# EAGLE design Orion CanSat Europe (EAGLE 9.2.2)
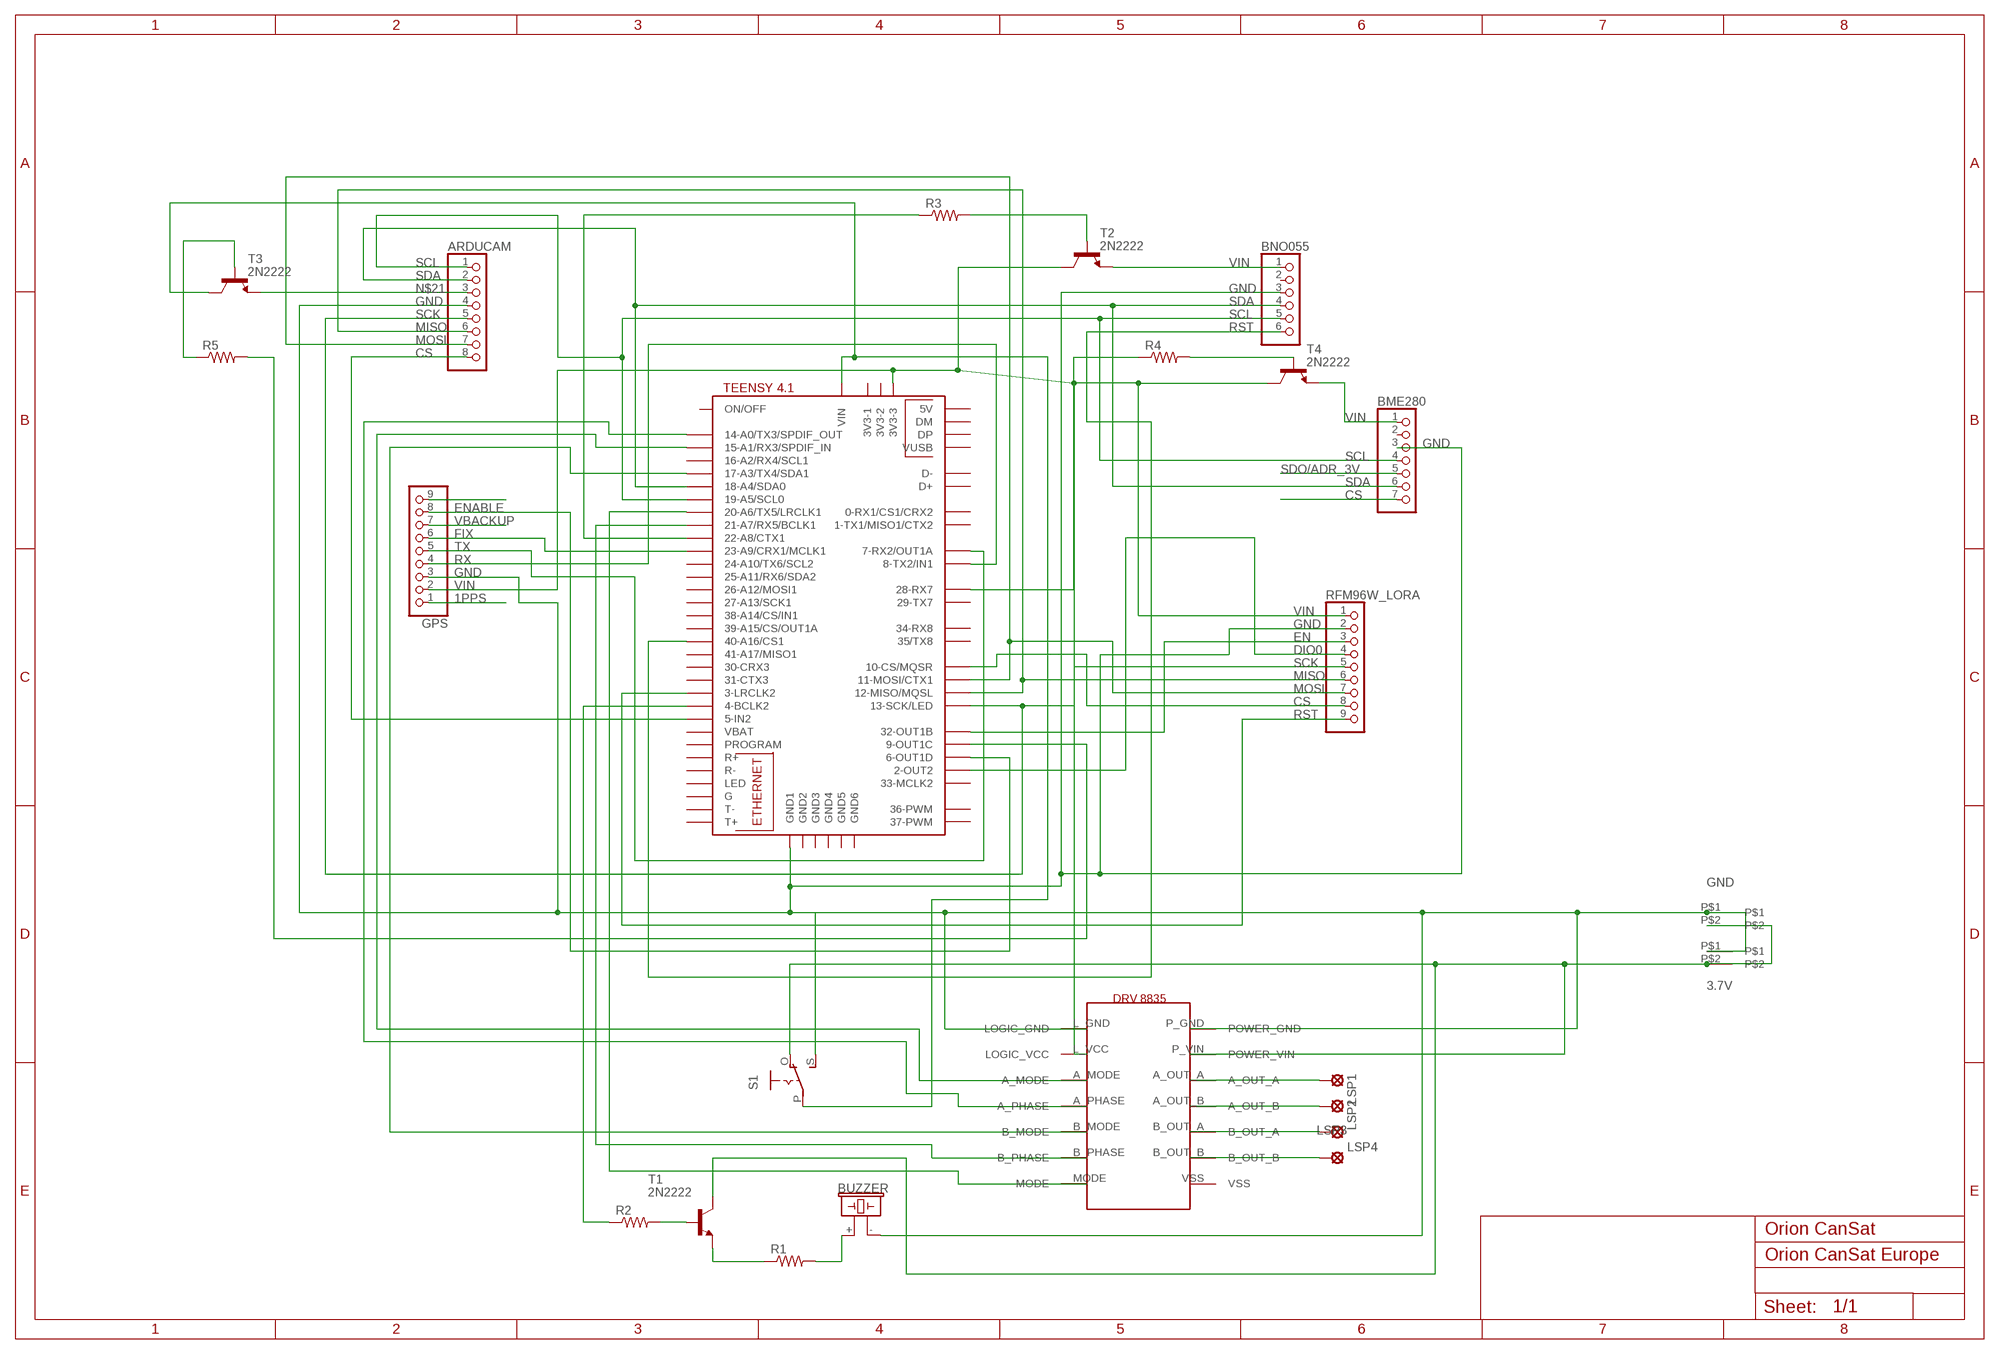
[diagram p0: schematic, sheet 1]

## Parts
ARDUCAM  PINHD-1X8BIG  [1X08-BIG]
BME280  HEADER-1X770MIL  [1X07_ROUND_70]
BNO055  HEADER-1X676MIL  [1X06_ROUND_76]
GPS  HEADER-1X970MIL  [1X09_ROUND_70]
LSP1  LSP13  [LSP13]
LSP2  LSP13  [LSP13]
LSP3  LSP13  [LSP13]
LSP4  LSP13  [LSP13]
R1  FLIPFLOP-RES  [0805-THM]
R2  FLIPFLOP-RES  [0805-THM]
R3  FLIPFLOP-RES  [0805-THM]
R4  FLIPFLOP-RES  [0805-THM]
R5  FLIPFLOP-RES  [0805-THM]
RFM96W_LORA  HEADER-1X970MIL  [1X09_ROUND_70]
S1  EG1218S  [EG1218]
SG2  F/CM12P  [F/CM12P]
T1  2N2222  [TO92-EBC-OVAL]
T2  2N2222  [TO92-EBC-OVAL]
T3  2N2222  [TO92-EBC-OVAL]
T4  2N2222  [TO92-EBC-OVAL]
U$1  DRV8835  [DRV8835]
U$5  TEENSY41  [TEENSY41]
U$7  2PINS  [2PINS]
U$8  2PINS  [2PINS]

## Nets
1PPS: GPS.1
BZPWR: R1.2 SG2.+
CS: ARDUCAM.8 U$5.5-IN2
CS_5V: BME280.7 RFM96W_LORA.8 U$5.10-CS\MQSR(10-CS/MQSR)
DIO0: RFM96W_LORA.4 U$5.2-OUT2
EN: RFM96W_LORA.3 U$5.32-OUT1B
ENABLE: GPS.8 U$5.6-OUT1D
FIX: GPS.6 U$5.23-A9/CRX1/MCLK1
GND: ARDUCAM.4 BME280.3 BNO055.3 GPS.3 RFM96W_LORA.2 S1.S SG2.- U$1.L_GND(LOGIC_GND) U$1.P_GND(POWER_GND) U$5.GND1 U$7.P$1 U$8.P$1
MISO: ARDUCAM.6 RFM96W_LORA.6 U$5.12-MISO/MQSL
MOSI: ARDUCAM.7 RFM96W_LORA.7 U$5.11-MOSI/CTX1
N$1: R1.1 T1.E
N$2: U$1.MODE U$5.20-A6/TX5/LRCLK1
N$3: U$1.A_PHASE U$5.14-A0/TX3/SPDIF_OUT
N$4: R3.1 U$5.22-A8/CTX1
N$5: U$1.B_PHASE U$5.21-A7/RX5/BCLK1
N$6: R5.2 U$5.9-OUT1C
N$7: U$1.A_MODE U$5.15-A1/RX3/SPDIF_IN
N$8: R4.1 U$5.28-RX7
N$9: LSP1.MP U$1.A_OUT_A
N$10: R2.2 T1.B
N$11: LSP2.MP U$1.A_OUT_B
N$12: LSP3.MP U$1.B_OUT_A
N$13: LSP4.MP U$1.B_OUT_B
N$14: R4.2 T4.B
N$15: R3.2 T2.B
N$16: GPS.2 RFM96W_LORA.1 T2.C T4.C U$1.L_VCC(LOGIC_VCC) U$5.3V3-3
N$17: U$1.B_MODE U$5.17-A3/TX4/SDA1
N$18: GPS.9
N$19: BNO055.1 T2.E
N$20: BME280.1 T4.E
N$21: ARDUCAM.3 T3.E
N$22: S1.P T3.C U$5.VIN
N$23: R5.1 T3.B
N$24: S1.O T1.C U$1.P_VIN(POWER_VIN) U$7.P$2 U$8.P$2
N$29: R2.1 U$5.4-BCLK2
RST: BNO055.6 RFM96W_LORA.9 U$5.3-LRCLK2 U$5.40-A16/CS1
RX: GPS.4 U$5.8-TX2/IN1
SCK: ARDUCAM.5 RFM96W_LORA.5 U$5.13-SCK/LED
SCL: ARDUCAM.1 BME280.4 BNO055.5 U$5.19-A5/SCL0
SDA: ARDUCAM.2 BME280.6 BNO055.4 U$5.18-A4/SDA0
SDO/ADR_3V: BME280.5
TX: GPS.5 U$5.7-RX2/OUT1A
VBACKUP: GPS.7
Unconnected: BME280.2 BNO055.2 U$1.VSS U$5.0-RX1/CS1/CRX2 U$5.1-TX1/MISO1/CTX2 U$5.3V3-1 U$5.3V3-2 U$5.16-A2/RX4/SCL1 U$5.24-A10/TX6/SCL2 U$5.25-A11/RX6/SDA2 U$5.26-A12/MOSI1 U$5.27-A13/SCK1 U$5.29-TX7 U$5.30-CRX3 U$5.31-CTX3 U$5.33-MCLK2 U$5.34-RX8 U$5.35-TX8(35/TX8) U$5.36-PWM U$5.37-PWM U$5.38-A14/CS/IN1 U$5.39-A15/CS/OUT1A U$5.41-A17/MISO1 U$5.+5V(5V) U$5.D+ U$5.D- U$5.DM U$5.DP U$5.G U$5.GND2 U$5.GND3 U$5.GND4 U$5.GND5 U$5.GND6 U$5.LED U$5.ON/OFF U$5.PROGRAM U$5.R+ U$5.R- U$5.T+ U$5.T- U$5.VBAT U$5.VUSB

## Notes on the sheet
- VIN
- GND
- VIN
- GND
- CS
- GND
- VIN
- VIN
- GND
- CS
- 9V_BATTERY
- GND
- VIN | GND
- 3.7V
- BUZZER
- Orion CanSat

## Library data of the parts
ARDUCAM = adafruit:PINHD-1X8: PIN HEADER
BME280 = microbuilder:HEADER-1X7: PIN HEADER
BNO055 = microbuilder:HEADER-1X6: PIN HEADER
GPS RFM96W_LORA = microbuilder:HEADER-1X9: PIN HEADER
LSP1-LSP4 = solpad:LSP13: SOLDER PAD drill 1.3 mm, distributor Buerklin, 12H562
R1-R5 = adafruit:FLIPFLOP-RES: Flip Flop resistor An 0805 resistor inside a standard 1/4W 5% resistor. Makes for easy mods
S1 = switch:EG1218: SLIDING SWITCH 0.1" spacing through hole, vertical SPDT slide switch http://www.ladyada.net/library/pcb/eaglelibrary.html
SG2 = buzzer:F/CM12P: BUZZER Source: Buerklin; OC_FARNELL: unknown; OC_NEWARK: unknown
T1-T4 = adafruit:2N2222: NPN TRANSISTOR Big oval pads
U$1 = DRV 8835:DRV8835
U$5 = teensy:TEENSY41
U$7 U$8 = 6pins:2PINS

## Board
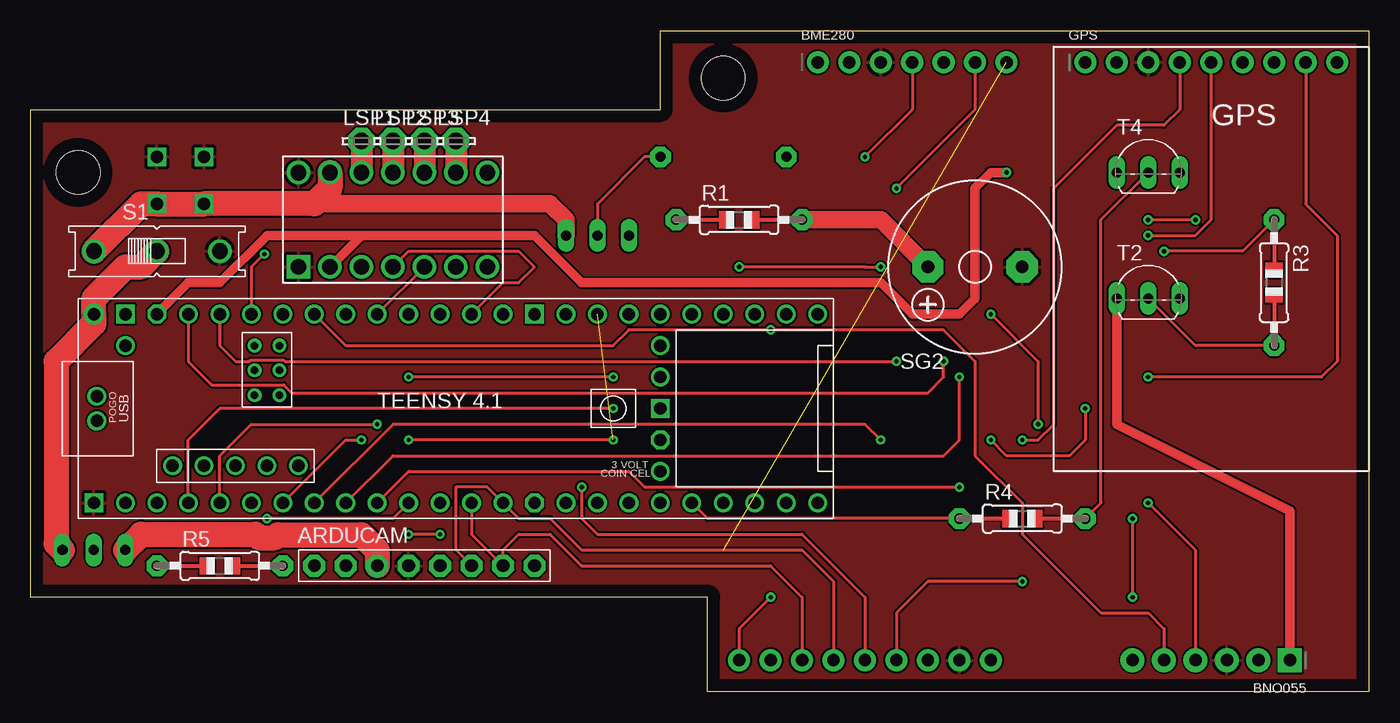
[diagram p1: board, top side]
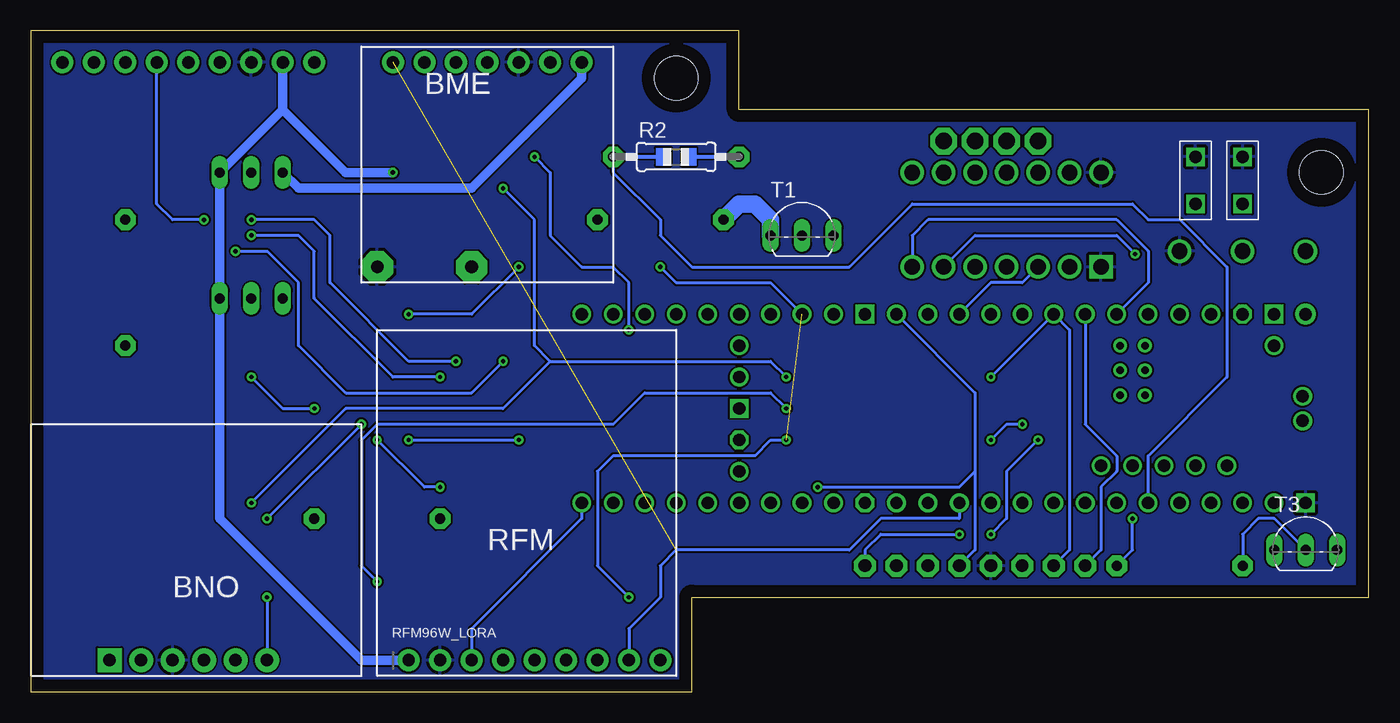
[diagram p2: board, bottom side, seen from below]

Size 107.95 x 53.34 mm. Coordinates in mm from the lower left corner, seen from the top.
Outline: 0,46.99 50.8,46.99 50.8,53.34 107.95,53.34 107.95,0 54.61,0 54.61,7.62 0,7.62 0,46.99
Copper layers (1*16): Top 0.035mm / dielectric 1.5mm / Bottom 0.035mm
Design rules "default": minimum track width 6mil, minimum drill 0.35mm, track to track 6mil, track to pad 6mil, pad to pad 6mil, via to via 6mil, smd to smd 6mil, copper to edge 40mil, drill to drill 6mil, minimum pad ring 10mil, minimum via ring 8mil, stop-mask expansion 4mil, vias tented up to drill 0mil, thermal gap 10mil
Holes 3.5 mm at 55.88,49.53 3.81,41.91

### Footprints (pad centres in the part's own frame; a part is rotated, then mirrored left to right if it is on the bottom)
1X08-BIG = drill 1.016 pad 1.778 octagon: 1 -8.89,0; 2 -6.35,0; 3 -3.81,0; 4 -1.27,0; 5 1.27,0; 6 3.81,0; 7 6.35,0; 8 8.89,0
1X07_ROUND_70 = drill 1 pad 1.778: 1 -7.62,0; 2 -5.08,0; 3 -2.54,0; 4 0,0; 5 2.54,0; 6 5.08,0; 7 7.62,0
1X06_ROUND_76 = drill 1 pad 1.93 square: 1 -6.35,0 | drill 1 pad 1.93: 2 -3.81,0; 3 -1.27,0; 4 1.27,0; 5 3.81,0; 6 6.35,0
1X09_ROUND_70 = drill 1 pad 1.778: 1 -10.16,0; 2 -7.62,0; 3 -5.08,0; 4 -2.54,0; 5 0,0; 6 2.54,0; 7 5.08,0; 8 7.62,0; 9 10.16,0
LSP13 = drill 1.321 pad 2.159 octagon: MP 0,0
0805-THM = drill 0.813 pad 1.676 octagon: 1 -5.08,0; 2 5.08,0
EG1218 = drill 1.27 pad 1.676: O -5.08,0; P 0,0; S 5.08,0
F/CM12P = drill 1.016 pad 2.54 octagon: + 3.81,0; - -3.81,0
TO92-EBC-OVAL = drill 0.813 long: B 0,-1.27; C 2.54,-1.27; E -2.54,-1.27
DRV8835 = drill 1.27: A_MODE -3.81,3.81; A_OUT_A 3.81,3.81; A_OUT_B 3.81,1.27; A_PHASE -3.81,1.27; B_MODE -3.81,-1.27; B_OUT_A 3.81,-1.27; B_OUT_B 3.81,-3.81; B_PHASE -3.81,-3.81; L_VCC -3.81,6.35; MODE -3.81,-6.35; P_GND 3.81,8.89; P_VIN 3.81,6.35; VSS 3.81,-6.35 | drill 1.27 square: L_GND -3.81,8.89
TEENSY41 = drill 1: 0-RX1/CS1/CRX2 -27.94,-7.62; 1-TX1/MISO1/CTX2 -25.4,-7.62; 2-OUT2 -22.86,-7.62; 3-LRCLK2 -20.32,-7.62; 4-BCLK2 -17.78,-7.62; 5-IN2 -15.24,-7.62; 6-OUT1D -12.7,-7.62; 7-RX2/OUT1A -10.16,-7.62; 8-TX2/IN1 -7.62,-7.62; 9-OUT1C -5.08,-7.62; 10-CS\MQSR -2.54,-7.62; 11-MOSI/CTX1 0,-7.62; 12-MISO/MQSL 2.54,-7.62; 13-SCK/LED 2.54,7.62; 14-A0/TX3/SPDIF_OUT 0,7.62; 15-A1/RX3/SPDIF_IN -2.54,7.62; 16-A2/RX4/SCL1 -5.08,7.62; 17-A3/TX4/SDA1 -7.62,7.62; 18-A4/SDA0 -10.16,7.62; 19-A5/SCL0 -12.7,7.62; 20-A6/TX5/LRCLK1 -15.24,7.62; 21-A7/RX5/BCLK1 -17.78,7.62; 22-A8/CTX1 -20.32,7.62; 23-A9/CRX1/MCLK1 -22.86,7.62; 24-A10/TX6/SCL2 7.62,-7.62; 25-A11/RX6/SDA2 10.16,-7.62; 26-A12/MOSI1 12.7,-7.62; 27-A13/SCK1 15.24,-7.62; 28-RX7 17.78,-7.62; 29-TX7 20.32,-7.62; 30-CRX3 22.86,-7.62; 31-CTX3 25.4,-7.62; 32-OUT1B 27.94,-7.62; 33-MCLK2 27.94,7.62; 34-RX8 25.4,7.62; 35-TX8 22.86,7.62; 36-PWM 20.32,7.62; 37-PWM 17.78,7.62; 38-A14/CS/IN1 15.24,7.62; 39-A15/CS/OUT1A 12.7,7.62; 40-A16/CS1 10.16,7.62; 41-A17/MISO1 7.62,7.62; +5V -24.13,-4.62; D+ -30.25,-1; D- -30.25,1; DM -21.59,-4.62; DP -19.05,-4.62; GND4 -16.51,-4.62; GND5 -13.97,-4.62; ON/OFF 15.24,5.08; PROGRAM 15.24,2.54; VBAT 15.24,-5.08; VUSB -27.94,5.08 | drill 1 octagon: 3V3-1 5.08,-7.62; 3V3-2 15.24,-2.54; 3V3-3 -25.4,7.62 | drill 0.6: G -15.51,3.08; LED -17.51,3.08; R+ -17.51,5.08; R- -15.51,5.08; T+ -15.51,1.08; T- -17.51,1.08 | drill 1 square: GND1 -30.48,-7.62; GND2 15.24,0; GND3 5.08,7.62; GND6 -27.94,7.62 | drill 1 pad 1.676: VIN -30.48,7.62
2PINS = drill 1 square: P$1 0,2.54; P$2 0,-1.27

### Placement (x,y rotation side)
ARDUCAM  31.75,10.16 0 top
BME280  71.12,50.8 0 top
BNO055  95.25,2.54 180 top
GPS  95.25,50.8 0 top
LSP1  26.67,44.45 0 top
LSP2  29.21,44.45 0 top
LSP3  31.75,44.45 0 top
LSP4  34.29,44.45 0 top
R1  57.15,38.1 0 top
R2  55.88,43.18 0 bottom
R3  100.33,33.02 270 top
R4  80.01,13.97 0 top
R5  15.24,10.16 0 top
RFM96W_LORA  67.31,2.54 0 bottom
S1  10.16,35.56 0 top
SG2  76.2,34.29 180 top
T1  45.72,38.1 0 bottom
T2  90.17,33.02 0 top
T3  5.08,12.7 0 bottom
T4  90.17,43.18 0 top
U$1  30.48,38.1 90 top
U$5  35.56,22.86 0 top
U$7  10.16,40.64 0 top
U$8  13.97,40.64 0 top

### Tracks (layer width: path | path; a pad name or v marks a point on that pad's centre or on a via)
BZPWR
  Top 1.397: SG2.+ 68.58,38.1 R1.2
CS  (via drill 0.35)
  Top 0.254: v26.67,20.32 25.4,20.32 U$5.5-IN2 | v33.02,12.7 v30.48,12.7
  Bottom 0.254: v26.67,20.32 29.21,17.78 29.21,13.97 v30.48,12.7 | ARDUCAM.8 40.64,11.43 39.37,12.7 v33.02,12.7
CS_5V  (1 unrouted)
  Bottom 0.254: U$5.10-CS\MQSR 33.02,13.97 39.37,13.97 41.91,11.43 55.88,11.43 57.15,10.16 57.15,7.62 59.69,5.08 RFM96W_LORA.8
DIO0  (via drill 0.35)
  Top 0.254: U$5.2-OUT2 12.7,20.32 15.24,22.86 v46.99,22.86 | v80.01,8.89 72.39,8.89 69.85,6.35 RFM96W_LORA.4
  Bottom 0.254: v46.99,22.86 48.26,24.13 58.42,24.13 60.96,21.59 80.01,21.59 81.28,20.32 81.28,10.16 v80.01,8.89
EN
  Bottom 0.254: U$5.32-OUT1B 63.5,13.97 72.39,5.08 RFM96W_LORA.3
ENABLE  (via drill 0.35)
  Top 0.254: U$5.6-OUT1D 29.21,21.59 67.31,21.59 v68.58,20.32 | GPS.8 102.87,39.37 105.41,36.83 105.41,26.67 104.14,25.4 v90.17,25.4 | v85.09,22.86 85.09,20.32 83.82,19.05 78.74,19.05 v77.47,20.32
  Bottom 0.254: v90.17,25.4 87.63,22.86 v85.09,22.86 | v77.47,20.32 v68.58,20.32
FIX  (via drill 0.35)
  Top 0.254: U$5.23-A9/CRX1/MCLK1 12.7,26.67 14.6,24.77 20.39,24.77 21.04,24.13 72.39,24.13 73.66,25.4 v73.66,26.67 | v90.17,38.1 v93.98,38.1
  Bottom 0.254: v73.66,26.67 77.47,26.67 83.82,33.02 83.82,36.83 85.09,38.1 v90.17,38.1 | v93.98,38.1 96.52,38.1 97.79,39.37 GPS.6
GND
  pour Top: -1.27,54.61 -1.27,-1.27 110.49,-1.27 110.49,54.61
  pour Bottom: -2.54,-2.54 -2.54,55.88 111.76,55.88 111.76,-2.54
MISO
  Top 0.254: ARDUCAM.6 34.29,11.43 34.29,16.51 36.83,16.51 U$5.12-MISO/MQSL 39.37,13.97 41.91,13.97 44.45,11.43 62.23,11.43 64.77,8.89 RFM96W_LORA.6
MOSI
  Top 0.254: U$5.11-MOSI/CTX1 35.56,12.7 ARDUCAM.7 38.1,11.43 39.37,12.7 41.91,12.7 44.45,10.16 59.69,10.16 62.23,7.62 RFM96W_LORA.7
N$1
  Bottom 1.397: R1.1 50.8,39.37 49.53,39.37 48.26,38.1 T1.E
N$2
  Bottom 0.254: U$5.20-A6/TX5/LRCLK1 17.78,33.02 17.78,35.56 20.32,38.1 35.56,38.1 36.83,36.83 U$1.MODE
N$3
  Top 0.254: U$1.A_PHASE 30.48,35.56 39.37,35.56 40.64,34.29 39.37,33.02 38.1,33.02 U$5.14-A0/TX3/SPDIF_OUT
N$4  (via drill 0.35)
  Top 0.254: U$5.22-A8/CTX1 15.24,27.94 16.51,26.67 17.6,26.67 17.7,26.77 20.39,26.77 20.5,26.67 v69.85,26.67 | R3.1 100.18,37.95 100.15,37.95 99.9,37.7 99.9,37.67 97.79,35.56 v91.44,35.56
  Bottom 0.254: v69.85,26.67 72.39,24.13 82.55,24.13 86.36,27.94 86.36,33.02 88.9,35.56 v91.44,35.56
N$5  (via drill 0.35)
  Top 0.254: U$5.21-A7/RX5/BCLK1 17.78,34.29 18.82,35.33 v18.84,35.33
  Bottom 0.254: U$1.B_PHASE 31.75,36.83 20.32,36.83 18.82,35.33 v18.84,35.33
N$6  (via drill 0.35)
  Top 0.254: v19.05,13.97 29.21,13.97 U$5.9-OUT1C
  Bottom 0.254: R5.2 19.05,11.43 v19.05,13.97
N$7
  Bottom 0.254: U$5.15-A1/RX3/SPDIF_IN 30.48,33.02 27.94,33.02 U$1.A_MODE
N$8
  Top 0.254: U$5.28-RX7 54.61,13.97 R4.1
N$9
  Top 1.778: LSP1.MP U$1.A_OUT_A
N$10
  Top 0.254: T1.B 45.72,39.37 49.53,43.18 R2.2
N$11
  Top 1.778: LSP2.MP U$1.A_OUT_B
N$12
  Top 1.778: LSP3.MP U$1.B_OUT_A
N$13
  Top 1.778: LSP4.MP U$1.B_OUT_B
N$14
  Top 0.254: T4.B 86.36,38.1 86.36,15.24 R4.2
N$15
  Top 0.254: T2.B 93.98,27.94 R3.2
N$16  (via drill 0.35)
  Top 0.762: 26.67,36.83 40.64,36.83 44.45,33.02 68.58,33.02 71.12,30.48 74.93,30.48 76.2,31.75 76.2,40.64 77.47,41.91 v78.74,41.91 | U$1.L_VCC 26.67,36.83 | 26.67,36.83 19.05,36.83 15.24,33.02 12.7,33.02 U$5.3V3-3
  Bottom 0.762: RFM96W_LORA.1 81.28,2.54 92.71,13.97 T2.C T4.C 87.63,46.99 | v78.74,41.91 82.55,41.91 87.63,46.99 | GPS.2 87.63,46.99
N$17
  Top 0.254: U$1.B_MODE U$5.17-A3/TX4/SDA1
N$19
  Top 0.762: T2.E 87.63,21.59 101.6,14.61 BNO055.1
N$20
  Bottom 0.762: T4.E 86.36,40.64 72.39,40.64 63.5,49.53 BME280.1
N$21
  Top 2.032: T3.E 8.89,12.7 18.13,12.7 18.41,12.42 19.69,12.42 19.94,12.68 26.67,12.68 27.94,11.41 ARDUCAM.3
N$22
  Top 2.032: T3.C 2.03,11.94 2.03,26.67 5.08,29.72 U$5.VIN 5.08,31.75 7.62,34.29 8.89,34.29 S1.P
N$23
  Bottom 0.254: R5.1 10.16,12.7 8.89,13.97 7.62,13.97 T3.B
N$24
  Top 1.397: 22.86,39.4 41.91,39.4 41.91,39.37 43.18,38.1 T1.C
  Top 2.032: S1.O 8.89,39.37 U$7.P$2 U$8.P$2 13.99,39.4 22.86,39.4 22.89,39.4 24.13,40.64 U$1.P_VIN
N$29
  Bottom 0.254: U$5.4-BCLK2 17.78,19.05 11.43,25.4 11.43,34.29 15.24,38.1 17.78,38.1 19.05,39.37 36.83,39.37 41.91,34.29 54.61,34.29 57.15,36.83 57.15,38.1 60.96,41.91 R2.1
RST  (via drill 0.35)  (1 unrouted)
  Top 0.254: U$5.3-LRCLK2 15.24,19.05 17.78,21.59 v27.94,21.59 | v46.99,20.32 v30.48,20.32 | v57.15,34.29 67.31,34.29 v68.58,34.29 | v77.47,30.48 81.28,26.67 v81.28,21.59 | v59.69,7.62 57.15,5.08 RFM96W_LORA.9 | v88.9,13.97 v88.9,7.62
  Bottom 0.254: v30.48,20.32 29.21,21.59 v27.94,21.59 | v46.99,20.32 48.26,20.32 49.53,19.05 60.96,19.05 62.23,17.78 62.23,10.16 v59.69,7.62 | U$5.40-A16/CS1 48.26,33.02 55.88,33.02 v57.15,34.29 | v68.58,34.29 72.38,30.48 v77.47,30.48 | v81.28,21.59 v88.9,13.97 | v88.9,7.62 BNO055.6
RX  (via drill 0.35)
  Top 0.254: GPS.4 92.71,46.99 91.44,45.72 87.63,45.72 82.55,40.64 82.55,21.59 81.28,20.32 v80.01,20.32 | U$5.8-TX2/IN1 30.48,17.78 48.26,17.78 49.53,16.51 v74.93,16.51
  Bottom 0.254: v74.93,16.51 76.2,16.51 v80.01,20.32
SCK  (via drill 0.35)
  Top 0.254: v44.45,16.51 44.45,13.97 45.72,12.7 62.23,12.7 67.31,7.62 RFM96W_LORA.5
  Bottom 0.254: ARDUCAM.5 31.75,11.43 31.75,17.78 | U$5.13-SCK/LED 31.75,24.13 31.75,17.78 | v44.45,16.51 33.02,16.51 31.75,17.78
SCL  (via drill 0.35)
  Top 0.254: U$5.19-A5/SCL0 25.4,27.94 46.99,27.94 48.26,29.21 v59.69,29.21 73.66,29.21 76.2,26.67 76.2,19.05 80.01,15.24 80.01,12.7 86.36,6.35 90.17,6.35 91.44,5.08 BNO055.5 | BME280.4 71.12,46.99 v67.31,43.18
  Bottom 0.254: ARDUCAM.1 21.59,11.43 21.59,16.51 20.32,17.78 20.32,19.05 22.86,21.59 U$5.19-A5/SCL0 | v67.31,43.18 66.04,41.91 66.04,36.83 63.5,34.29 60.96,34.29 59.69,33.02 v59.69,29.21
SDA  (via drill 0.35)
  Top 0.254: v46.99,25.4 v30.48,25.4 | v69.85,40.64 76.2,46.99 BME280.6 | BNO055.4 93.98,11.43 v90.17,15.24
  Bottom 0.254: ARDUCAM.2 24.13,11.43 24.13,29.21 U$5.18-A4/SDA0 v30.48,25.4 | 66.04,26.67 48.26,26.67 v46.99,25.4 | 66.04,26.67 69.85,22.86 82.55,22.86 v90.17,15.24 | 66.04,26.67 67.31,27.94 67.31,38.1 v69.85,40.64
TX  (via drill 0.35)
  Top 0.254: U$5.7-RX2/OUT1A 29.21,19.05 73.66,19.05 74.93,20.32 v74.93,25.4 | v90.17,36.83 93.98,36.83 95.25,38.1 GPS.5
  Bottom 0.254: v74.93,25.4 78.74,25.4 85.09,31.75 85.09,35.56 86.36,36.83 v90.17,36.83

### Text on the board
tNames: GPS
bNames: BME | RFM | BNO
tValues: DRV 8835